# Altium schematic sheet MCU_F103VCT6.SchDoc
size 381 x 241 mm; SheetNumber: 1; SheetTotal: 6
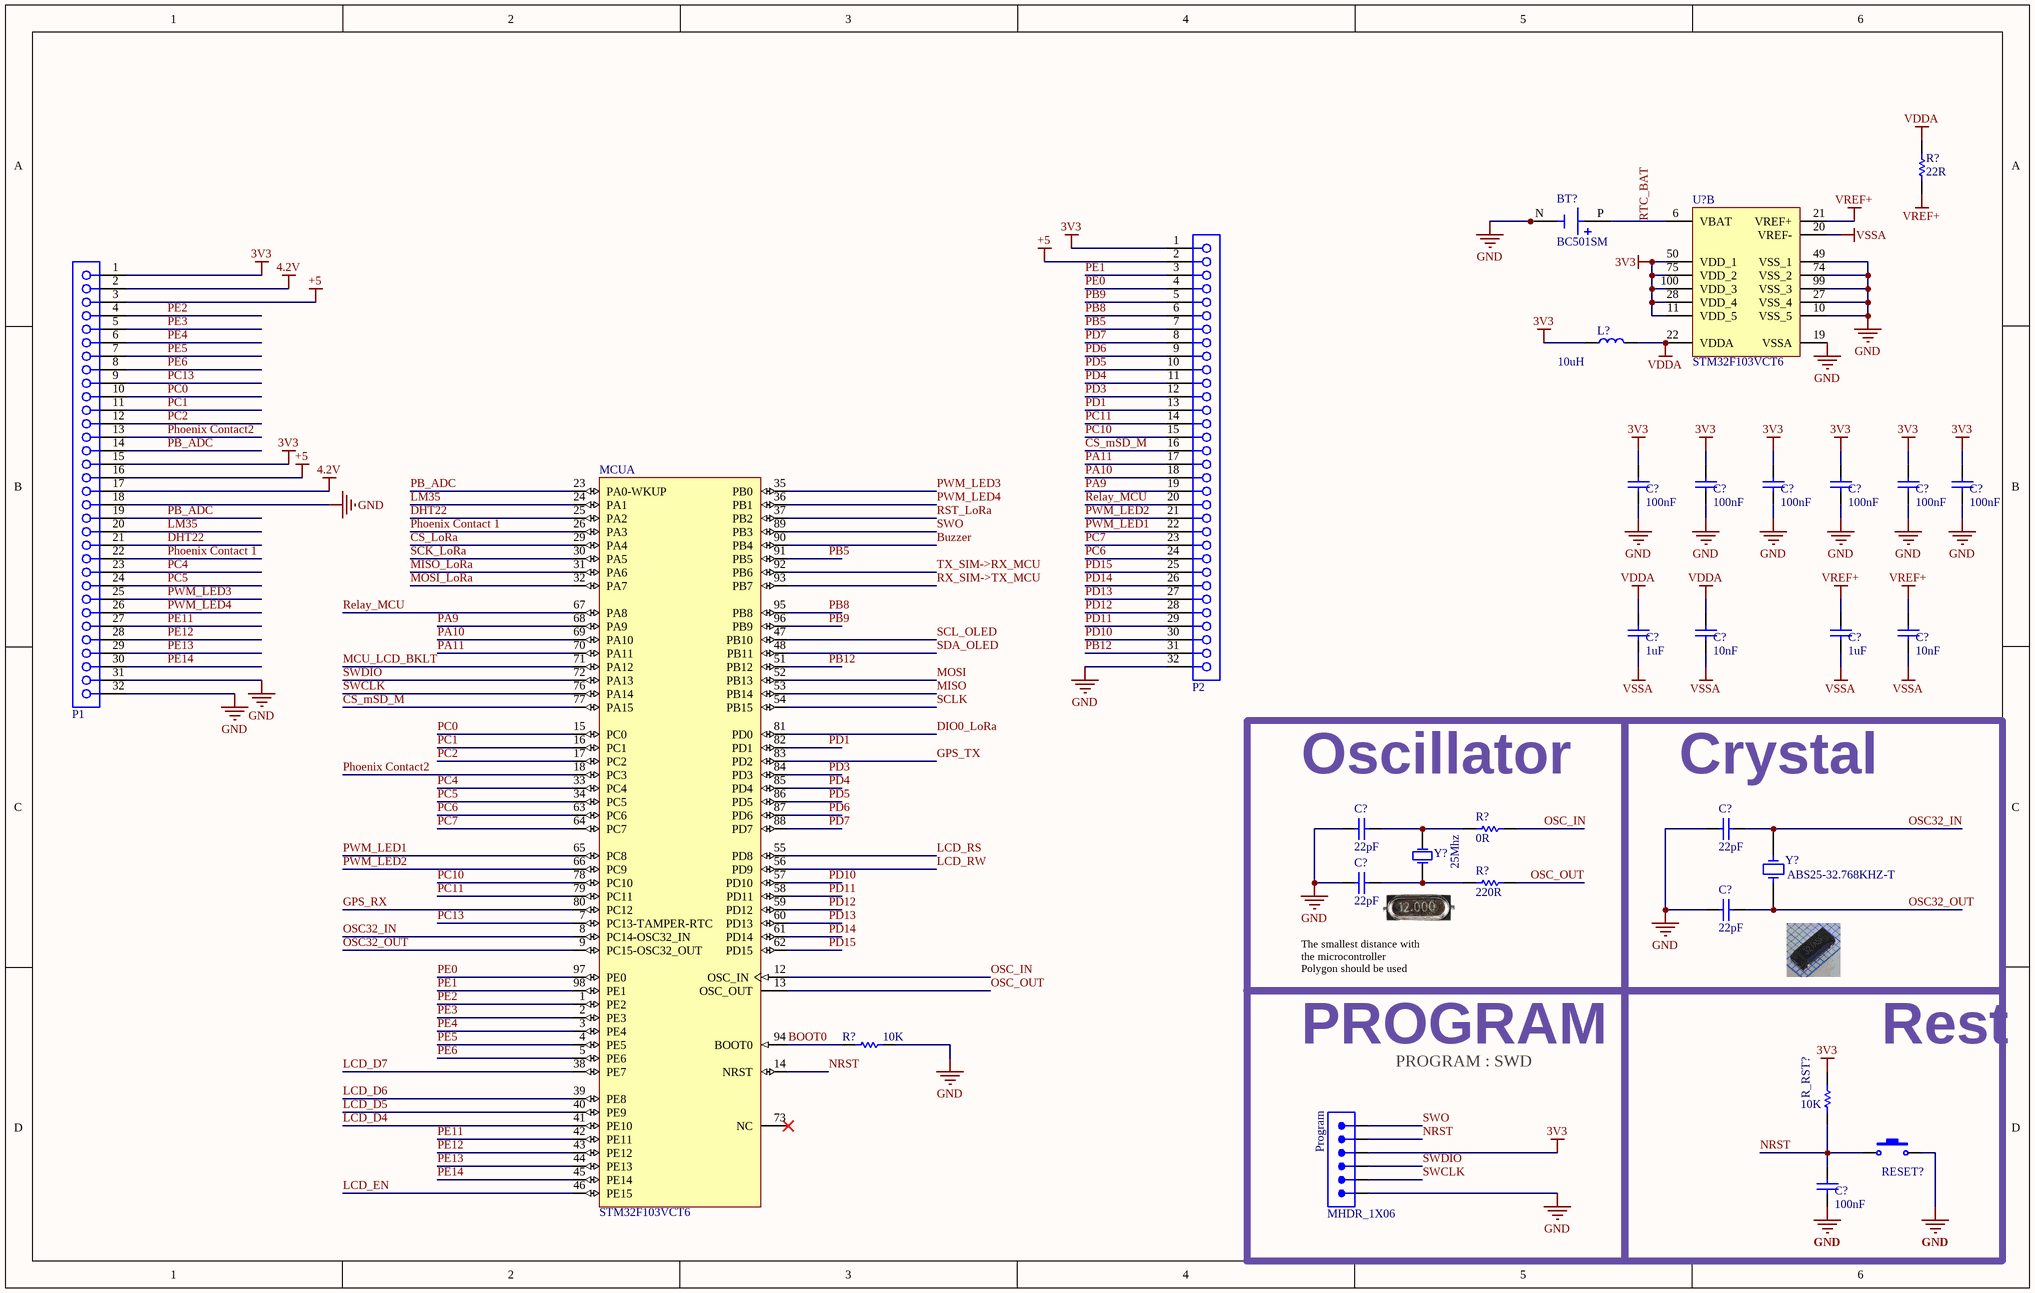
[diagram p0: MCU_F103VCT6.SchDoc]

## Parts
(Parts that share a designator on the sheet are numbered #1, #2 ... from top to bottom, then left to right.)
BT?  BC501SM  [BAT_BC501SM]
C?#1  100nF  [MY_CAP_SMD_0603]
C?#2  100nF  [MY_CAP_SMD_0603]
C?#3  100nF  [MY_CAP_SMD_0603]
C?#4  100nF  [MY_CAP_SMD_0603]
C?#5  100nF  [MY_CAP_SMD_0603]
C?#6  100nF  [MY_CAP_SMD_0603]
C?#7  1uF  [MY_CAP_SMD_0603]
C?#8  10nF  [MY_CAP_SMD_0603]
C?#9  1uF  [MY_CAP_SMD_0603]
C?#10  10nF  [MY_CAP_SMD_0603]
C?#11  22pF  [MY_CAP_SMD_0603]
C?#12  22pF  [MY_CAP_SMD_0603]
C?#13  22pF  [MY_CAP_SMD_0603]
C?#14  22pF  [MY_CAP_SMD_0603]
C?#15  100nF  [MY_CAP_SMD_0603]
L?  10uH  [L0603E]
MCU  STM32F103VCT6  [STM-LQFP100_N]  (part A of 2)
P1  61303211821  [61303211821]  (value not drawn)
P2  61303211821  [61303211821]  (value not drawn)
Program  MHDR_1X06  [MHDR1X06-254P]
R?#1  22R  [R0603]
R?#2  0R  [R0603]
R?#3  220R  [R0603]
R?#4  10K  [R0603]
R_RST?  10K  [RESC4817X04N]
RESET?  Switch PB  [Switch - Push to On]  (value not drawn)
U?  STM32F103VCT6  [STM-LQFP100_N]  (part B of 2)
Y?#1  25Mhz  [Crystal]
Y?#2  ABS25-32.768KHZ-T  [XTAL_ABS25-32.768KHZ-6-1-T]

## Blocks framed on the sheet
Oscillator: C?#11 C?#13 R?#2 R?#3 Y?#1
Crystal: C?#12 C?#14 Y?#2
PROGRAM: Program
Rest: C?#15 R_RST? RESET?

## Nets
3V3: C?#1.1 C?#2.1 C?#3.1 C?#4.1 C?#5.1 C?#6.1 L?.1 P1.1 P1.15 P2.1 Program.3 R_RST?.2 U?.11(VDD_5) U?.28(VDD_4) U?.50(VDD_1) U?.75(VDD_2) U?.100(VDD_3)
4.2V: P1.2 P1.17
+5: P1.3 P1.16 P2.2
GND: BT?.N(NEG) C?#1.2 C?#2.2 C?#3.2 C?#4.2 C?#5.2 C?#6.2 C?#11.1 C?#12.1 C?#13.1 C?#14.1 C?#15.2 P1.18 P1.31 P1.32 P2.32 Program.6 R?#4.1 RESET?.2 U?.10(VSS_5) U?.19(VSSA) U?.27(VSS_4) U?.49(VSS_1) U?.74(VSS_2) U?.99(VSS_3)
VDDA: C?#7.1 C?#8.1 L?.2 R?#1.1 U?.22(VDDA)
VREF+: C?#9.1 C?#10.1 R?#1.2 U?.21(VREF+)
VSSA: C?#7.2 C?#8.2 C?#9.2 C?#10.2 U?.20(VREF-)
BOOT0: MCU.94(BOOT0) R?#4.2
Buzzer: MCU.90(PB4)
CS_LoRa: MCU.29(PA4)
CS_mSD_M: MCU.77(PA15) P2.16
DHT22: MCU.25(PA2) P1.21
DIO0_LoRa: MCU.81(PD0)
GPS_RX: MCU.80(PC12)
GPS_TX: MCU.83(PD2)
LCD_D4: MCU.41(PE10)
LCD_D5: MCU.40(PE9)
LCD_D6: MCU.39(PE8)
LCD_D7: MCU.38(PE7)
LCD_EN: MCU.46(PE15)
LCD_RS: MCU.55(PD8)
LCD_RW: MCU.56(PD9)
LM35: MCU.24(PA1) P1.20
MCU_LCD_BKLT: MCU.71(PA12)
MISO: MCU.53(PB14)
MISO_LoRa: MCU.31(PA6)
MOSI: MCU.52(PB13)
MOSI_LoRa: MCU.32(PA7)
NRST: C?#15.1 MCU.14(NRST) Program.2 R_RST?.1 RESET?.1
OSC32_IN: C?#12.2 MCU.8(PC14-OSC32_IN) Y?#2.4
OSC32_OUT: C?#14.2 MCU.9(PC15-OSC32_OUT) Y?#2.1
OSC_IN: MCU.12(OSC_IN) R?#2.1
OSC_OUT: MCU.13(OSC_OUT) R?#3.1
PA9: MCU.68(PA9) P2.19
PA10: MCU.69(PA10) P2.18
PA11: MCU.70(PA11) P2.17
PB5: MCU.91(PB5) P2.7
PB8: MCU.95(PB8) P2.6
PB9: MCU.96(PB9) P2.5
PB12: MCU.51(PB12) P2.31
PB_ADC: MCU.23(PA0-WKUP) P1.14 P1.19
PC0: MCU.15(PC0) P1.10
PC1: MCU.16(PC1) P1.11
PC2: MCU.17(PC2) P1.12
PC4: MCU.33(PC4) P1.23
PC5: MCU.34(PC5) P1.24
PC6: MCU.63(PC6) P2.24
PC7: MCU.64(PC7) P2.23
PC10: MCU.78(PC10) P2.15
PC11: MCU.79(PC11) P2.14
PC13: MCU.7(PC13-TAMPER-RTC) P1.9
PD1: MCU.82(PD1) P2.13
PD3: MCU.84(PD3) P2.12
PD4: MCU.85(PD4) P2.11
PD5: MCU.86(PD5) P2.10
PD6: MCU.87(PD6) P2.9
PD7: MCU.88(PD7) P2.8
PD10: MCU.57(PD10) P2.30
PD11: MCU.58(PD11) P2.29
PD12: MCU.59(PD12) P2.28
PD13: MCU.60(PD13) P2.27
PD14: MCU.61(PD14) P2.26
PD15: MCU.62(PD15) P2.25
PE0: MCU.97(PE0) P2.4
PE1: MCU.98(PE1) P2.3
PE2: MCU.1(PE2) P1.4
PE3: MCU.2(PE3) P1.5
PE4: MCU.3(PE4) P1.6
PE5: MCU.4(PE5) P1.7
PE6: MCU.5(PE6) P1.8
PE11: MCU.42(PE11) P1.27
PE12: MCU.43(PE12) P1.28
PE13: MCU.44(PE13) P1.29
PE14: MCU.45(PE14) P1.30
Phoenix Contact2: MCU.18(PC3) P1.13
Phoenix Contact 1: MCU.26(PA3) P1.22
PWM_LED1: MCU.65(PC8) P2.22
PWM_LED2: MCU.66(PC9) P2.21
PWM_LED3: MCU.35(PB0) P1.25
PWM_LED4: MCU.36(PB1) P1.26
Relay_MCU: MCU.67(PA8) P2.20
RST_LoRa: MCU.37(PB2)
RTC_BAT: BT?.P(POS) U?.6(VBAT)
RX_SIM->TX_MCU: MCU.93(PB7)
SCK_LoRa: MCU.30(PA5)
SCL_OLED: MCU.47(PB10)
SCLK: MCU.54(PB15)
SDA_OLED: MCU.48(PB11)
SWCLK: MCU.76(PA14) Program.5
SWDIO: MCU.72(PA13) Program.4
SWO: MCU.89(PB3) Program.1
TX_SIM->RX_MCU: MCU.92(PB6)
NetC?#11_2: C?#11.2 R?#2.2 Y?#1.2(OSC2)
NetC?#13_2: C?#13.2 R?#3.2 Y?#1.1(OSC1)

Not connected (* = marked no-connect by the designer): MCU 73(NC)*

## Notes on the sheet
- The smallest distance with the microcontroller
  Polygon should be used
- PROGRAM : SWD

## Library data of the parts
BT? = BC501SM: BATTERY HOLDER COIN 12MM SMD; MF: MPD; SnapEDA_Link: https://www.snapeda.com/parts/BC501SM/MPD/view-part/?ref=snap; Package: None; MP: BC501SM; Price: None; Availability: Unavailable; Check_prices: https://www.snapeda.com/parts/BC501SM/MPD/view-part/?ref=eda; Value: *
C?#1-C?#15 = CAP SMD_0603: 1.6 mm × 0.8 mm
L? = Inductor SMD NC 0603: DatasheetVersion: 2021; ComponentLink1Description: Website Smart World; ComponentLink1URL: https://www.smartw.ir/; ComponentLink2Description: Telegram; ComponentLink2URL: https://t.me/altium_smartw; ComponentLink3Description: Instagram; ComponentLink3URL: https://Instagram.com/smartgw.ir
MCU U? = STM32F103VCT6: ARM Cortex-M3 32-bit MCU, 256 KB Flash, 48 KB Internal RAM, 80 I/Os, 100-pin LQFP, -40 to 85 degC, Tray; ComponentLink1Description: Website Smart World; ComponentLink1URL: https://www.smartw.ir/
P1 P2 = 61303211821: WR-PHD Socket Header, THT, Vertical, pitch 2.54mm, 1 Row, 32P; Manufacturer: Wurth Elektronik; Contact Resistance: 20mOhm; Rated Current: 3A; Working Voltage: 250V; Withstanding Voltage: 500V; Manufacturer Part Number: 61303211821; Category: Board-to-Board Connectors; Match Code: WR-PHD; ComponentLink1Description: Website Link; ComponentLink1URL: https://www.we-online.com/redexpert/article/61303211821?ad; ComponentLink2Description: Datasheet Link; ComponentLink2URL: https://www.we-online.com/redexpert/spec/61303211821?ad; Mount: Through Hole; Operating Temperature Max: 105°C; Operating Temperature Min: -40°C; Packaging: Tray; Gender: Socket Header; Number of Pins: 32; Number of Rows: 1; Orientation: Vertical; Pitch: 2.54mm
Program = MHDR_1X06: Male Header 1X06
R?#1-R?#4 = Resistor SMD 0603: Value: 1K; DatasheetVersion: 2021; ComponentLink1Description: Website Smart World; ComponentLink1URL: https://www.smartw.ir/; ComponentLink2Description: Telegram; ComponentLink2URL: https://t.me/altium_smartw; ComponentLink3Description: Instagram; ComponentLink3URL: https://Instagram.com/smartgw.ir
R_RST? = RES 1206 0.25W: RES 1206; Designer: Abbas Basereh; Desc.: RES SMD 1206; Data: 16-12-2016
RESET? = Switch PB: Push Button Switch
Y?#1 = XTAL: Crystal Oscillator; Published: 8-Jun-2000; LatestRevisionDate: 17-Jul-2002; LatestRevisionNote: Re-released for DXP Platform.; PackageReference: R38; Publisher: Altium Limited
Y?#2 = ABS25-32.768KHZ-T: 32.768kHz Â±20ppm Crystal 12.5pF 50 kOhms 4-SOJ, 5.50mm pitch; MF: Abracon LLC; Package: 4-4 Abracon LLC; MP: ABS25-32.768KHZ; Value: *; Availability: Unavailable; Price: None; SnapEDA_Link: https://www.snapeda.com/parts/ABS25-32.768KHZ/Abracon%20LLC/view-part/478888/?ref=snap